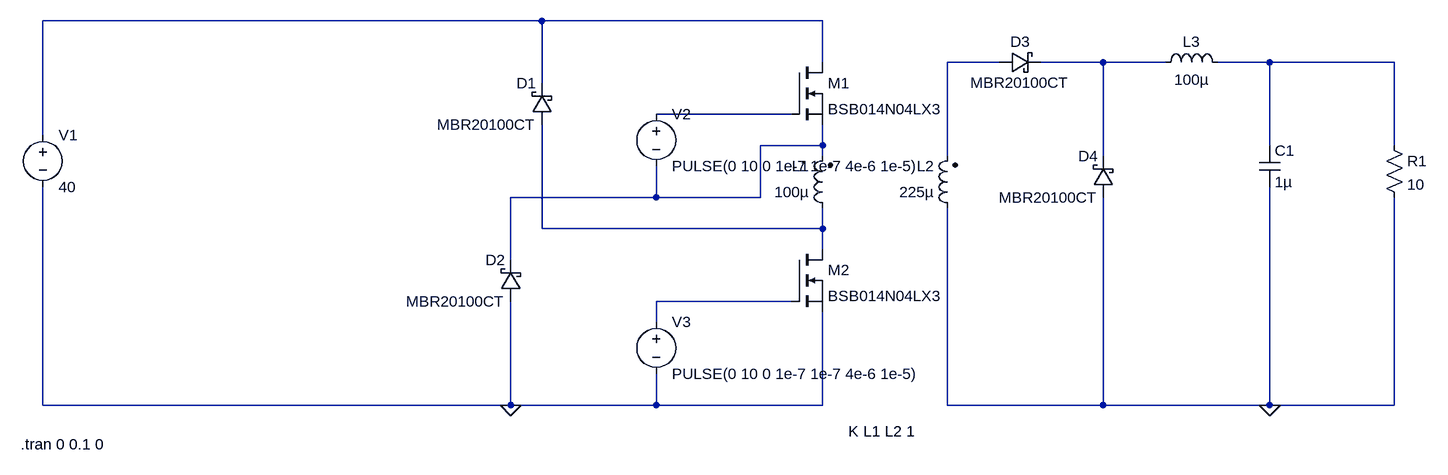
[diagram p0: schematic Draft1.asc]
Draft1.asc, the LTspice schematic file:
Version 4
SHEET 1 1720 680
WIRE 352 -64 -416 -64
WIRE 784 -64 352 -64
WIRE 784 0 784 -64
WIRE 1056 0 976 0
WIRE 1216 0 1120 0
WIRE 1312 0 1216 0
WIRE 1472 0 1392 0
WIRE 1664 0 1472 0
WIRE 352 32 352 -64
WIRE 736 80 528 80
WIRE -416 112 -416 -64
WIRE 784 128 784 96
WIRE 784 128 688 128
WIRE 1472 128 1472 0
WIRE 1664 128 1664 0
WIRE 784 144 784 128
WIRE 976 144 976 0
WIRE 1216 144 1216 0
WIRE 528 208 528 160
WIRE 528 208 304 208
WIRE 688 208 688 128
WIRE 688 208 528 208
WIRE 352 256 352 96
WIRE 784 256 784 224
WIRE 784 256 352 256
WIRE 784 288 784 256
WIRE 304 304 304 208
WIRE 736 368 528 368
WIRE 528 400 528 368
WIRE -416 528 -416 192
WIRE 304 528 304 368
WIRE 304 528 -416 528
WIRE 528 528 528 480
WIRE 528 528 304 528
WIRE 784 528 784 384
WIRE 784 528 528 528
WIRE 976 528 976 224
WIRE 1216 528 1216 208
WIRE 1216 528 976 528
WIRE 1472 528 1472 192
WIRE 1472 528 1216 528
WIRE 1664 528 1664 208
WIRE 1664 528 1472 528
FLAG 304 528 0
FLAG 1472 528 0
SYMBOL voltage -416 96 R0
SYMATTR InstName V1
SYMATTR Value 40
SYMBOL voltage 528 64 R0
SYMATTR InstName V2
SYMATTR Value PULSE(0 10 0 1e-7 1e-7 4e-6 1e-5)
SYMBOL voltage 528 384 R0
WINDOW 123 0 0 Left 0
WINDOW 39 0 0 Left 0
SYMATTR InstName V3
SYMATTR Value PULSE(0 10 0 1e-7 1e-7 4e-6 1e-5)
SYMBOL schottky 368 96 R180
WINDOW 0 24 64 Left 2
WINDOW 3 24 0 Left 2
SYMATTR InstName D1
SYMATTR Value MBR20100CT
SYMATTR Description Diode
SYMATTR Type diode
SYMBOL schottky 320 368 R180
WINDOW 0 24 64 Left 2
WINDOW 3 24 0 Left 2
SYMATTR InstName D2
SYMATTR Value MBR20100CT
SYMATTR Description Diode
SYMATTR Type diode
SYMBOL nmos 736 0 R0
SYMATTR InstName M1
SYMATTR Value BSB014N04LX3
SYMBOL nmos 736 288 R0
SYMATTR InstName M2
SYMATTR Value BSB014N04LX3
SYMBOL ind2 800 240 R180
WINDOW 0 36 80 Left 2
WINDOW 3 36 40 Left 2
SYMATTR InstName L1
SYMATTR Value 100µ
SYMATTR Type ind
SYMBOL ind2 992 240 R180
WINDOW 0 36 80 Left 2
WINDOW 3 36 40 Left 2
SYMATTR InstName L2
SYMATTR Value 225µ
SYMATTR Type ind
SYMBOL schottky 1056 16 R270
WINDOW 0 32 32 VTop 2
WINDOW 3 0 32 VBottom 2
SYMATTR InstName D3
SYMATTR Value MBR20100CT
SYMATTR Description Diode
SYMATTR Type diode
SYMBOL schottky 1232 208 R180
WINDOW 0 24 64 Left 2
WINDOW 3 24 0 Left 2
SYMATTR InstName D4
SYMATTR Value MBR20100CT
SYMATTR Description Diode
SYMATTR Type diode
SYMBOL ind 1296 16 R270
WINDOW 0 32 56 VTop 2
WINDOW 3 5 56 VBottom 2
SYMATTR InstName L3
SYMATTR Value 100µ
SYMBOL cap 1456 128 R0
SYMATTR InstName C1
SYMATTR Value 1µ
SYMBOL res 1648 112 R0
SYMATTR InstName R1
SYMATTR Value 10
TEXT 824 568 Left 2 !K L1 L2 1
TEXT -450 588 Left 2 !.tran 0 0.1 0

The netlist it stands for:
* Draft1.asc
V1 N001 0 40
V2 N005 N006 PULSE(0 10 0 1e-7 1e-7 4e-6 1e-5)
V3 N008 0 PULSE(0 10 0 1e-7 1e-7 4e-6 1e-5)
D1 N007 N001 MBR20100CT
D2 0 N006 MBR20100CT
M1 N001 N005 N006 N006 BSB014N04LX3
M2 N007 N008 0 0 BSB014N04LX3
L1 N007 N006 100µ
L2 0 N002 225µ
D3 N002 N003 MBR20100CT
D4 0 N003 MBR20100CT
L3 N003 N004 100µ
C1 N004 0 1µ
R1 N004 0 10
.model D D
.lib standard.dio
.model NMOS NMOS
.model PMOS PMOS
.lib standard.mos
K L1 L2 1
.tran 0 0.1 0
.backanno
.end